# EAGLE schematic AVR_KSPIO (EAGLE 6.6.0)
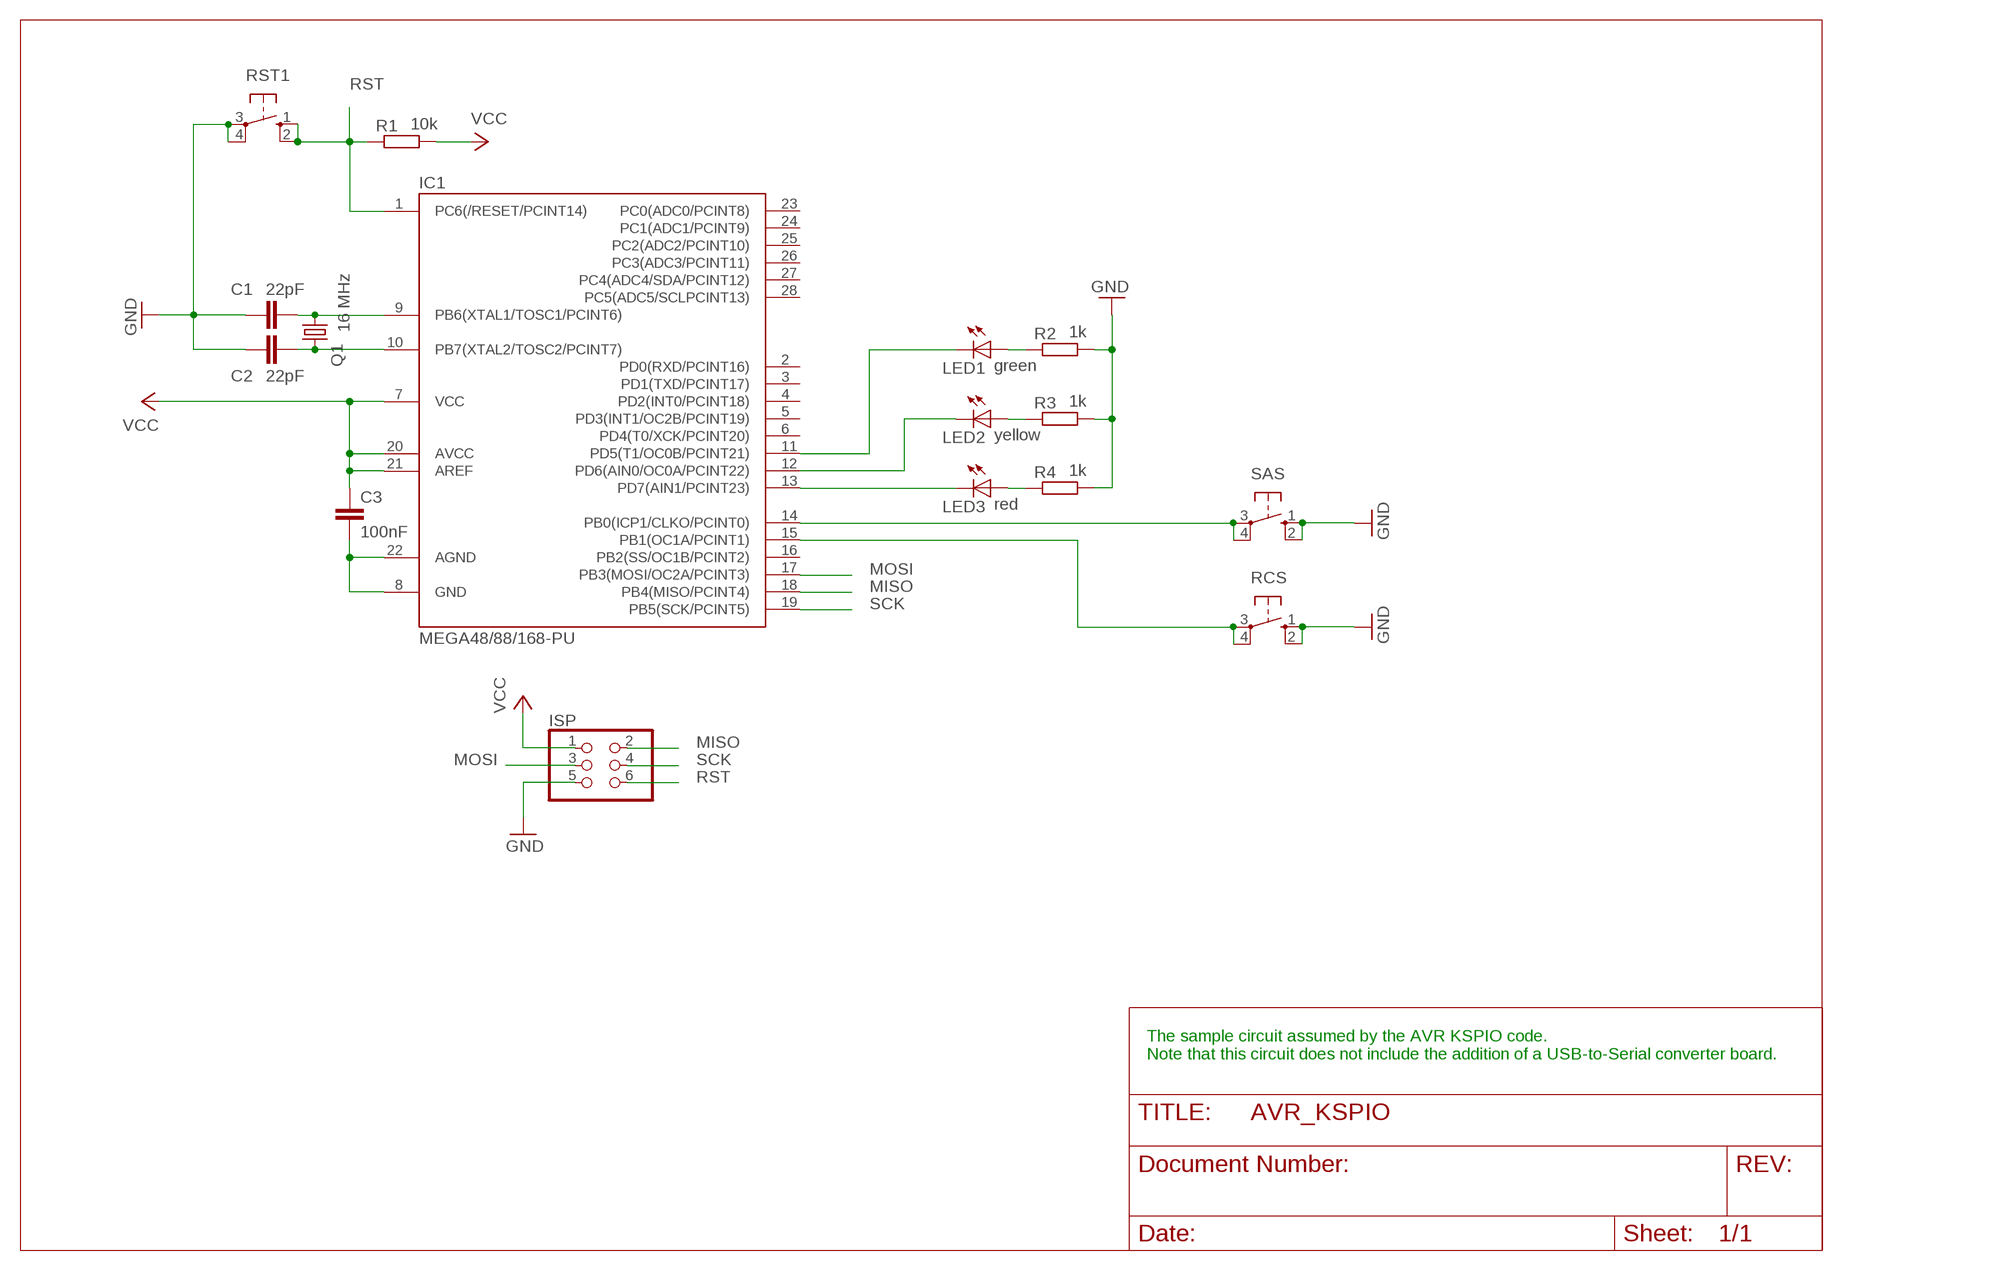
[diagram p0: schematic, sheet 1]

## Parts
C1  22pF  C-EU025-024X044  [C025-024X044]
C2  22pF  C-EU025-024X044  [C025-024X044]
C3  100nF  C-EU025-024X044  [C025-024X044]
IC1  MEGA48/88/168-PU  [DIL28-3]
ISP  PINHD-2X3  [2X03]
LED1  green  LED3MM  [LED3MM]
LED2  yellow  LED3MM  [LED3MM]
LED3  red  LED3MM  [LED3MM]
Q1  16 MHz  CRYSTALHC49S  [HC49/S]
R1  10k  R-EU_0204/7  [0204/7]
R2  1k  R-EU_0204/7  [0204/7]
R3  1k  R-EU_0204/7  [0204/7]
R4  1k  R-EU_0204/7  [0204/7]
RCS  10-XX  [B3F-10XX]
RST1  10-XX  [B3F-10XX]
SAS  10-XX  [B3F-10XX]

## Nets
GND: C1.1 C2.1 ISP.5 R2.2 R3.2 R4.2 RCS.1(S) RCS.2(S1) RST1.3(P) RST1.4(P1) SAS.1(S) SAS.2(S1)
MISO: IC1.18(PB4(MISO/PCINT4)) ISP.2
MOSI: IC1.17(PB3(MOSI/OC2A/PCINT3)) ISP.3
N$1: C3.2 IC1.8(GND) IC1.22(AGND)
N$2: C1.2 IC1.9(PB6(XTAL1/TOSC1/PCINT6)) Q1.2
N$3: C2.2 IC1.10(PB7(XTAL2/TOSC2/PCINT7)) Q1.1
N$4: IC1.13(PD7(AIN1/PCINT23)) LED3.K(C)
N$5: IC1.12(PD6(AIN0/OC0A/PCINT22)) LED2.K(C)
N$6: IC1.11(PD5(T1/OC0B/PCINT21)) LED1.K(C)
N$7: LED1.A R2.1
N$8: LED2.A R3.1
N$9: LED3.A R4.1
N$10: IC1.14(PB0(ICP1/CLKO/PCINT0)) SAS.3(P) SAS.4(P1)
N$11: IC1.15(PB1(OC1A/PCINT1)) RCS.3(P) RCS.4(P1)
RST: IC1.1(PC6(/RESET/PCINT14)) ISP.6 R1.1 RST1.1(S) RST1.2(S1)
SCK: IC1.19(PB5(SCK/PCINT5)) ISP.4
VCC: C3.1 IC1.7(VCC) IC1.20(AVCC) IC1.21(AREF) ISP.1 R1.2
Unconnected: IC1.2(PD0(RXD/PCINT16)) IC1.3(PD1(TXD/PCINT17)) IC1.4(PD2(INT0/PCINT18)) IC1.5(PD3(INT1/OC2B/PCINT19)) IC1.6(PD4(T0/XCK/PCINT20)) IC1.16(PB2(SS/OC1B/PCINT2)) IC1.23(PC0(ADC0/PCINT8)) IC1.24(PC1(ADC1/PCINT9)) IC1.25(PC2(ADC2/PCINT10)) IC1.26(PC3(ADC3/PCINT11)) IC1.27(PC4(ADC4/SDA/PCINT12)) IC1.28(PC5(ADC5/SCLPCINT13))

## Notes on the sheet
- The sample circuit assumed by the AVR KSPIO code. 
  Note that this circuit does not include the addition of a USB-to-Serial converter board.

## Library data of the parts
C1-C3 = rcl:C-EU: CAPACITOR, European symbol
IC1 = avr-6:MEGA48/88/168-PU
ISP = pinhead:PINHD-2X3: PIN HEADER
LED1-LED3 = led:LED: LED OSRAM: - CHIPLED LG R971, LG N971, LY N971, LG Q971, LY Q971, LO R971, LY R971 LH N974, LH R974 LS Q976, LO Q976, LY Q976 LO Q996 - Hyper CHIPLED LW Q18S LB Q993, LB Q99A, LB R99A - SideLED LS A670, LO A670, LY A670, LG A670, LP A670 LB A673, LV A673, LT A673, LW A673 LH A674 LY A675 LS A676, LA A676, LO A676, LY A676, LW A676 LS A679, LY A679, LG A679 - Hyper Micro SIDELED® LS Y876, LA Y876, LO Y876, LY Y876 LT Y87S - SmartLED LW L88C, LW L88S LB L89C, LB L89S, LG L890 LS L89K, LO L89K, LY L89K LS L896, LA L896, LO L896, LY L896 - TOPLED LS T670, LO T670, LY T670, LG T670, LP T670 LSG T670, LSP T670, LSY T670, LOP T670, LYG T670 LG T671, LOG T671, LSG T671 LB T673, LV T673, LT T673, LW T673 LH T674 LS T676, LA T676, LO T676, LY T676, LB T676, LH T676, LSB T676, LW T676 LB T67C, LV T67C, LT T67C, LS T67K, LO T67K, LY T67K, LW E67C LS E67B, LA E67B, LO E67B, LY E67B, LB E67C, LV E67C, LT E67C LW T67C LS T679, LY T679, LG T679 LS T770, LO T770, LY T770, LG T770, LP T770 LB T773, LV T773, LT T773, LW T773 LH T774 LS E675, LA E675, LY E675, LS T675 LS T776, LA T776, LO T776, LY T776, LB T776 LHGB T686 LT T68C, LB T68C - Hyper Mini TOPLED® LB M676 - Mini TOPLED Santana® LG M470 LS M47K, LO M47K, LY M47K Source: http://www.osram.convergy.de LUXEON: - LUMILED® LXK2-PW12-R00, LXK2-PW12-S00, LXK2-PW14-U00, LXK2-PW14-V00 LXK2-PM12-R00, LXK2-PM12-S00, LXK2-PM14-U00 LXK2-PE12-Q00, LXK2-PE12-R00, LXK2-PE12-S00, LXK2-PE14-T00, LXK2-PE14-U00 LXK2-PB12-K00, LXK2-PB12-L00, LXK2-PB12-M00, LXK2-PB14-N00, LXK2-PB14-P00, LXK2-PB14-Q00 LXK2-PR12-L00, LXK2-PR12-M00, LXK2-PR14-Q00, LXK2-PR14-R00 LXK2-PD12-Q00, LXK2-PD12-R00, LXK2-PD12-S00 LXK2-PH12-R00, LXK2-PH12-S00 LXK2-PL12-P00, LXK2-PL12-Q00, LXK2-PL12-R00 Source: www.luxeon.com KINGBRIGHT: KA-3528ASYC Source: www.kingbright.com
Q1 = crystal:CRYSTAL: CRYSTAL; OC_FARNELL: 1667008; OC_NEWARK: unknown
R1-R4 = rcl:R-EU_: RESISTOR, European symbol
RCS RST1 SAS = switch-omron:10-XX: OMRON SWITCH; MPN: B3F-1000; OC_FARNELL: 176432; OC_NEWARK: 36M3542